# Altium schematic sheet distribution amp.schdoc
size A3
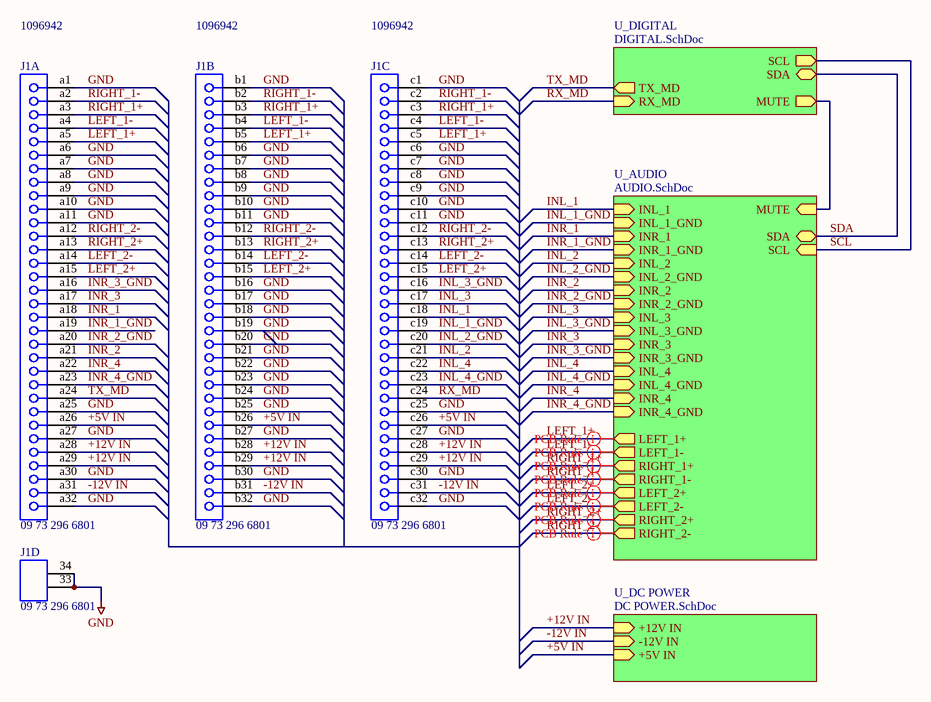
[diagram p0: distribution amp.schdoc]

## Parts
J1  09 73 296 6801  Supplier Part Number 3: 1096942  [0973296X801]  (parts A,B,C,D of 4)

## Sub-sheets
U_AUDIO = AUDIO.SchDoc: LEFT_1+ (out), LEFT_1- (out), RIGHT_1+ (out), RIGHT_1- (out), LEFT_2+ (out), LEFT_2- (out), RIGHT_2+ (out), RIGHT_2- (out), MUTE (in), INL_1 (in), INR_1 (in), INR_2 (in), INL_2 (in), INL_3 (in), INR_3 (in), INL_4 (in), INR_4 (in), SCL (in), SDA (bidir), INL_1_GND (in), INR_1_GND (in), INL_2_GND (in), INR_2_GND (in), INR_4_GND (in), INL_4_GND (in), INR_3_GND (in), INL_3_GND (in)
U_DC POWER = DC POWER.SchDoc: +12V IN (in), -12V IN (in), +5V IN (in)
U_DIGITAL = DIGITAL.SchDoc: SDA (bidir), SCL (out), MUTE (out), TX_MD (out), RX_MD (in)

## Nets
GND: J1.33(MH1) J1.34(MH2) J1.a1 J1.a6 J1.a7 J1.a8 J1.a9 J1.a10 J1.a11 J1.a25 J1.a27 J1.a30 J1.a32 J1.b1 J1.b6 J1.b7 J1.b8 J1.b9 J1.b10 J1.b11 J1.b16 J1.b17 J1.b18 J1.b19 J1.b20 J1.b21 J1.b22 J1.b23 J1.b24 J1.b25 J1.b27 J1.b30 J1.b32 J1.c1 J1.c6 J1.c7 J1.c8 J1.c9 J1.c10 J1.c11 J1.c25 J1.c27 J1.c30 J1.c32
+5V IN: J1.a26 J1.b26 J1.c26 ; sheet U_DC POWER/+5V IN
+12V IN: J1.a28 J1.a29 J1.b28 J1.b29 J1.c28 J1.c29 ; sheet U_DC POWER/+12V IN
-12V IN: J1.a31 J1.b31 J1.c31 ; sheet U_DC POWER/-12V IN
INL_1: J1.c18 ; sheet U_AUDIO/INL_1
INL_1_GND: J1.c19 ; sheet U_AUDIO/INL_1_GND
INL_2: J1.c21 ; sheet U_AUDIO/INL_2
INL_2_GND: J1.c20 ; sheet U_AUDIO/INL_2_GND
INL_3: J1.c17 ; sheet U_AUDIO/INL_3
INL_3_GND: J1.c16 ; sheet U_AUDIO/INL_3_GND
INL_4: J1.c22 ; sheet U_AUDIO/INL_4
INL_4_GND: J1.c23 ; sheet U_AUDIO/INL_4_GND
INR_1: J1.a18 ; sheet U_AUDIO/INR_1
INR_1_GND: J1.a19 ; sheet U_AUDIO/INR_1_GND
INR_2: J1.a21 ; sheet U_AUDIO/INR_2
INR_2_GND: J1.a20 ; sheet U_AUDIO/INR_2_GND
INR_3: J1.a17 ; sheet U_AUDIO/INR_3
INR_3_GND: J1.a16 ; sheet U_AUDIO/INR_3_GND
INR_4: J1.a22 ; sheet U_AUDIO/INR_4
INR_4_GND: J1.a23 ; sheet U_AUDIO/INR_4_GND
LEFT_1+: J1.a5 J1.b5 J1.c5 ; sheet U_AUDIO/LEFT_1+
LEFT_1-: J1.a4 J1.b4 J1.c4 ; sheet U_AUDIO/LEFT_1-
LEFT_2+: J1.a15 J1.b15 J1.c15 ; sheet U_AUDIO/LEFT_2+
LEFT_2-: J1.a14 J1.b14 J1.c14 ; sheet U_AUDIO/LEFT_2-
RIGHT_1+: J1.a3 J1.b3 J1.c3 ; sheet U_AUDIO/RIGHT_1+
RIGHT_1-: J1.a2 J1.b2 J1.c2 ; sheet U_AUDIO/RIGHT_1-
RIGHT_2+: J1.a13 J1.b13 J1.c13 ; sheet U_AUDIO/RIGHT_2+
RIGHT_2-: J1.a12 J1.b12 J1.c12 ; sheet U_AUDIO/RIGHT_2-
RX_MD: J1.c24 ; sheet U_DIGITAL/RX_MD
SCL: sheet U_AUDIO/SCL, sheet U_DIGITAL/SCL
SDA: sheet U_AUDIO/SDA, sheet U_DIGITAL/SDA
TX_MD: J1.a24 ; sheet U_DIGITAL/TX_MD
(unnamed): sheet U_AUDIO/MUTE, sheet U_DIGITAL/MUTE

## Layout directives
rule Undefined; rule Width Constraint [Pref Width = 25mil    Min Width = 15mil    Max Width = 250mil]: LEFT_1+, LEFT_1-, LEFT_2+, LEFT_2-, RIGHT_1+, RIGHT_1-, RIGHT_2+, RIGHT_2-

## Library data of the parts
J1 = 09 73 296 6801: Eurocard DIN 41612, Type R, 96 Position, Rows a+b+c, Performance level 2, Female, Lead 3.0 mm, Pitch 2.54 mm; Manufacturer: HARTING; Manufacturer Part No.: 09732966801; Mouser Part no.: 617-09-73-296-6801; Value: 09732966801; Web link: http://au.mouser.com/ProductDetail/HARTING/09732966801/?qs=qa49y27LPCFbWAgQmjjqsljhIHhtEdU7BdVlYk8VXic%3d; Supplier 1: Mouser; Supplier Part Number 1: 617-09-73-296-6801; Supplier 2: Digi-Key; Supplier Part Number 2: 1195-2893-ND; Supplier 3: Farnell